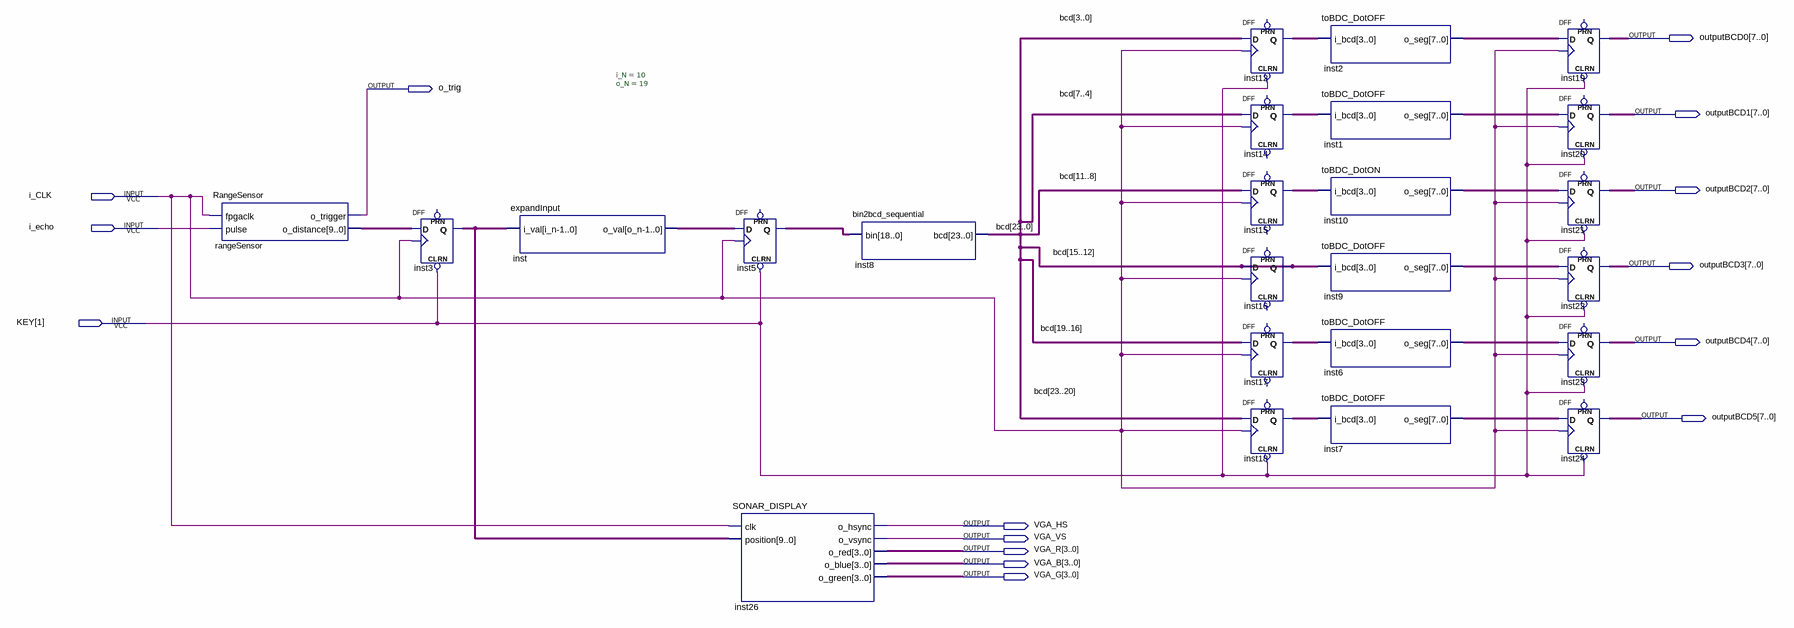
[diagram p0: schematic sheet]
// Quartus schematic Radar_FPGA.bdf as structural Verilog: 24 symbols, 15 pins
module Radar_FPGA (
  input  i_CLK,
  input  i_echo,
  input  [1:1] KEY,
  output [7:0] outputBCD0,
  output o_trig,
  output [7:0] outputBCD1,
  output [7:0] outputBCD2,
  output [7:0] outputBCD3,
  output [7:0] outputBCD4,
  output [7:0] outputBCD5,
  output VGA_HS,
  output VGA_VS,
  output [3:0] VGA_R,
  output [3:0] VGA_B,
  output [3:0] VGA_G
);

  wire [3:0] inst12_q, inst14_q, inst15_q, inst17_q, inst18_q;
  wire [7:0] inst1_o_seg, inst2_o_seg, inst6_o_seg, inst7_o_seg, inst9_o_seg, inst10_o_seg;
  wire [9:0] inst3_q, rangeSensor_o_distance;
  wire [18:0] inst5_q, inst_o_val;
  wire [23:0] bcd;

  RangeSensor rangeSensor (.fpgaclk(i_CLK), .pulse(i_echo), .o_trigger(o_trig), .o_distance(rangeSensor_o_distance));
  DFF inst3[9:0] (.CLRN(KEY[1]), .CLK(i_CLK), .D(rangeSensor_o_distance), .Q(inst3_q));  // open: PRN
  expandInput #(.i_N(10), .o_N(19)) inst (.i_val(inst3_q), .o_val(inst_o_val));
  DFF inst5[18:0] (.CLRN(KEY[1]), .CLK(i_CLK), .D(inst_o_val), .Q(inst5_q));  // open: PRN
  SONAR_DISPLAY inst26 (
    .clk(i_CLK), .position(inst3_q), .o_hsync(VGA_HS), .o_vsync(VGA_VS), .o_red(VGA_R), .o_blue(VGA_B),
    .o_green(VGA_G));
  bin2bcd_sequential inst8 (.bin(inst5_q), .bcd(bcd));
  DFF inst12[3:0] (.CLRN(KEY[1]), .CLK(i_CLK), .D(bcd[3:0]), .Q(inst12_q));  // open: PRN
  DFF inst14[3:0] (.CLK(i_CLK), .D(bcd[7:4]), .Q(inst14_q));  // open: CLRN, PRN
  DFF inst15[3:0] (.CLK(i_CLK), .D(bcd[11:8]), .Q(inst15_q));  // open: CLRN, PRN
  DFF inst16[3:0] (.CLK(i_CLK), .D(bcd[15:12]), .Q(bcd[15:12]));  // open: CLRN, PRN
  DFF inst17[3:0] (.CLK(i_CLK), .D(bcd[19:16]), .Q(inst17_q));  // open: CLRN, PRN
  DFF inst18[3:0] (.CLRN(KEY[1]), .CLK(i_CLK), .D(bcd[23:20]), .Q(inst18_q));  // open: PRN
  toBDC_DotOFF inst2 (.i_bcd(inst12_q), .o_seg(inst2_o_seg));
  toBDC_DotOFF inst1 (.i_bcd(inst14_q), .o_seg(inst1_o_seg));
  toBDC_DotON inst10 (.i_bcd(inst15_q), .o_seg(inst10_o_seg));
  toBDC_DotOFF inst9 (.i_bcd(bcd[15:12]), .o_seg(inst9_o_seg));
  toBDC_DotOFF inst6 (.i_bcd(inst17_q), .o_seg(inst6_o_seg));
  toBDC_DotOFF inst7 (.i_bcd(inst18_q), .o_seg(inst7_o_seg));
  DFF inst19[7:0] (.CLRN(KEY[1]), .CLK(i_CLK), .D(inst2_o_seg), .Q(outputBCD0));  // open: PRN
  DFF inst20[7:0] (.CLRN(KEY[1]), .CLK(i_CLK), .D(inst1_o_seg), .Q(outputBCD1));  // open: PRN
  DFF inst21[7:0] (.CLRN(KEY[1]), .CLK(i_CLK), .D(inst10_o_seg), .Q(outputBCD2));  // open: PRN
  DFF inst22[7:0] (.CLRN(KEY[1]), .CLK(i_CLK), .D(inst9_o_seg), .Q(outputBCD3));  // open: PRN
  DFF inst23[7:0] (.CLRN(KEY[1]), .CLK(i_CLK), .D(inst6_o_seg), .Q(outputBCD4));  // open: PRN
  DFF inst24[7:0] (.CLRN(KEY[1]), .CLK(i_CLK), .D(inst7_o_seg), .Q(outputBCD5));  // open: PRN
endmodule
